# Altium schematic sheet UI-Computer.SchDoc: RespiraWorks
size A3; CompanyName: RespiraWorks; DrawnBy: E. Chiu; Organization: Altium; DocumentNumber: 3; Revision: A1; SheetNumber: 3; SheetTotal: 8; PageSetup: Record=PageOptions|CenterHorizontal=True|CenterVertical=True|PrintScale=0.67|XCorrection=1.00|YCorrection=1.00|PrintKind=0|BorderSize=5000000|LeftOffset=0|BottomOffset=0|Orientation=2|PaperLength=1000|PaperWidth=1000|Scale=100|PaperSource=276|PrintQuality=-3|MediaType=1|DitherType=10|PrintScaleMode=1|PaperKind=11"x17" 279.4x431.8mm|PaperIndex=3; ProjectName: FALCON 3S
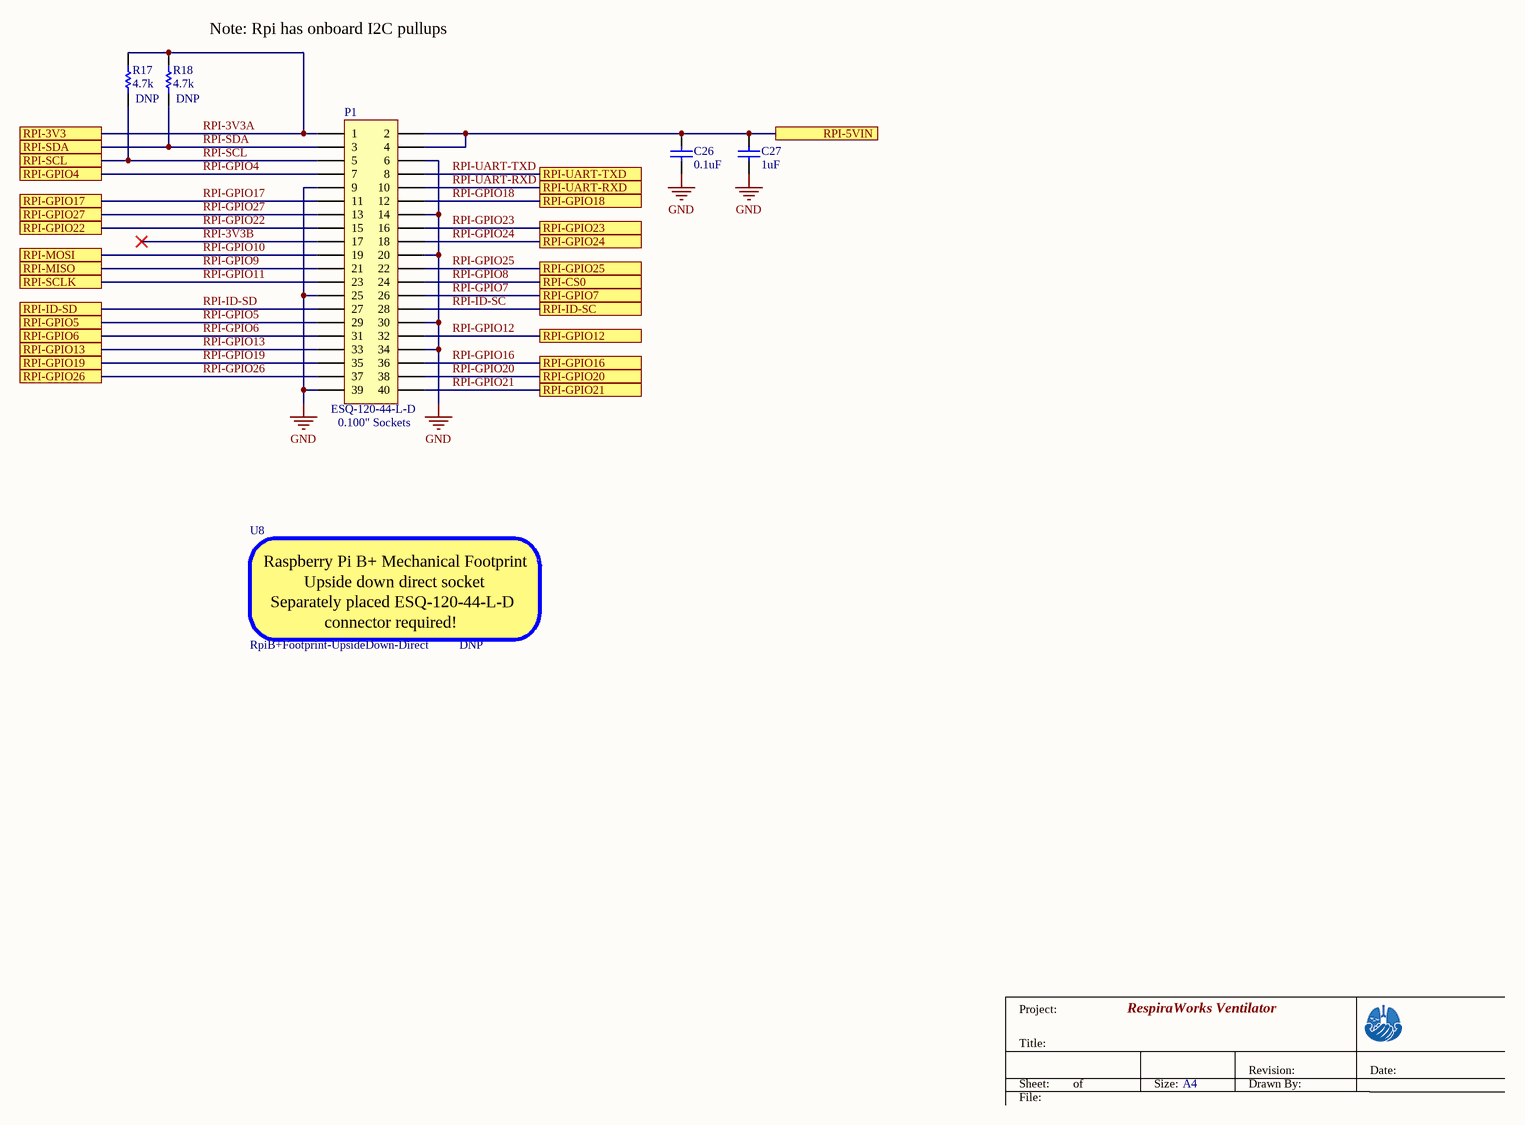
[diagram p0: UI-Computer.SchDoc]

## Parts
C26  value 0.1uF  [CAP0603]  (hidden comment: CAP 0603)
C27  value 1uF  [CAP0603]  (hidden comment: CAP 0603)
P1  0.100" Sockets  [ESQ-120-44-L-D]
R17  value 4.7k  Do Not Populate: DNP  [RES0603]  (hidden comment: RES 0603)
R18  value 4.7k  Do Not Populate: DNP  [RES0603]  (hidden comment: RES 0603)
U8  RpiB+Footprint-UpsideDown-Direct  Do Not Populate: DNP  [RpiB+UpsideDown-Direct]

## Ports
RPI-3V3, RPI-5VIN, RPI-CS0, RPI-GPIO4, RPI-GPIO5, RPI-GPIO6, RPI-GPIO7, RPI-GPIO12, RPI-GPIO13, RPI-GPIO16, RPI-GPIO17, RPI-GPIO18, RPI-GPIO19, RPI-GPIO20, RPI-GPIO21, RPI-GPIO22, RPI-GPIO23, RPI-GPIO24, RPI-GPIO25, RPI-GPIO26, RPI-GPIO27, RPI-ID-SC, RPI-ID-SD, RPI-MISO, RPI-MOSI, RPI-SCL, RPI-SCLK, RPI-SDA, RPI-UART-RXD, RPI-UART-TXD

## Nets
GND: C26.2 C27.2 P1.6 P1.9 P1.14 P1.20 P1.25 P1.30 P1.34 P1.39
RPI-3V3A: P1.1 R17.1 R18.1 ; port RPI-3V3
RPI-3V3B: P1.17
RPI-5VIN: C26.1 C27.1 P1.2 P1.4 ; port RPI-5VIN
RPI-GPIO4: P1.7 ; port RPI-GPIO4
RPI-GPIO5: P1.29 ; port RPI-GPIO5
RPI-GPIO6: P1.31 ; port RPI-GPIO6
RPI-GPIO7: P1.26 ; port RPI-GPIO7
RPI-GPIO8: P1.24 ; port RPI-CS0
RPI-GPIO9: P1.21 ; port RPI-MISO
RPI-GPIO10: P1.19 ; port RPI-MOSI
RPI-GPIO11: P1.23 ; port RPI-SCLK
RPI-GPIO12: P1.32 ; port RPI-GPIO12
RPI-GPIO13: P1.33 ; port RPI-GPIO13
RPI-GPIO16: P1.36 ; port RPI-GPIO16
RPI-GPIO17: P1.11 ; port RPI-GPIO17
RPI-GPIO18: P1.12 ; port RPI-GPIO18
RPI-GPIO19: P1.35 ; port RPI-GPIO19
RPI-GPIO20: P1.38 ; port RPI-GPIO20
RPI-GPIO21: P1.40 ; port RPI-GPIO21
RPI-GPIO22: P1.15 ; port RPI-GPIO22
RPI-GPIO23: P1.16 ; port RPI-GPIO23
RPI-GPIO24: P1.18 ; port RPI-GPIO24
RPI-GPIO25: P1.22 ; port RPI-GPIO25
RPI-GPIO26: P1.37 ; port RPI-GPIO26
RPI-GPIO27: P1.13 ; port RPI-GPIO27
RPI-ID-SC: P1.28 ; port RPI-ID-SC
RPI-ID-SD: P1.27 ; port RPI-ID-SD
RPI-SCL: P1.5 R17.2 ; port RPI-SCL
RPI-SDA: P1.3 R18.2 ; port RPI-SDA
RPI-UART-RXD: P1.10 ; port RPI-UART-RXD
RPI-UART-TXD: P1.8 ; port RPI-UART-TXD

## Notes on the sheet
- (near R18) Note: Rpi has onboard I2C pullups
- Project:
- RespiraWorks Ventilator
- Title:
- Sheet:
- of
- Size:
- A4
- Drawn By:
- Revision:
- Date:
- File:
- (in symbol RpiB+Footprint-UpsideDown-Direct) Raspberry Pi B+ Mechanical Footprint; Upside down direct socket; Separately placed ESQ-120-44-L-D; connector required!

## Library data of the parts
C26 = CAP 0603: Manufacturer P/N: CC0603KRX7R7BB104; Manufacturer: Yageo; Voltage: 16V; PCB Package: 0603; Type: X7R; Do Not Populate: *
C27 = CAP 0603: Manufacturer P/N: CC0603KRX7R6BB105; Manufacturer: Yageo; Voltage: 10V; PCB Package: 0603; Type: X7R; Do Not Populate: *
P1 = ESQ-120-44-L-D: Tall Female Header 0.100" Pitch 20x2 Sockets; Manufacturer: Samtec; Manufacturer P/N: ESQ-120-44-L-D; PCB Package: ESQ-120-44-L-D; Tolerance: *; Do Not Populate: *; Value: *
R17 R18 = RES 0603: Manufacturer P/N: RC0603FR-074K7L; Manufacturer: Yageo; PCB Package: 0603; Tolerance: 1%
U8 = RpiB+Footprint-UpsideDown-Direct: Raspberry Pi B+ Footprint direct on PCB; Manufacturer: Raspberry Pi; Manufacturer P/N: B+